# EAGLE design dual_sampler (EAGLE 8.3.2)
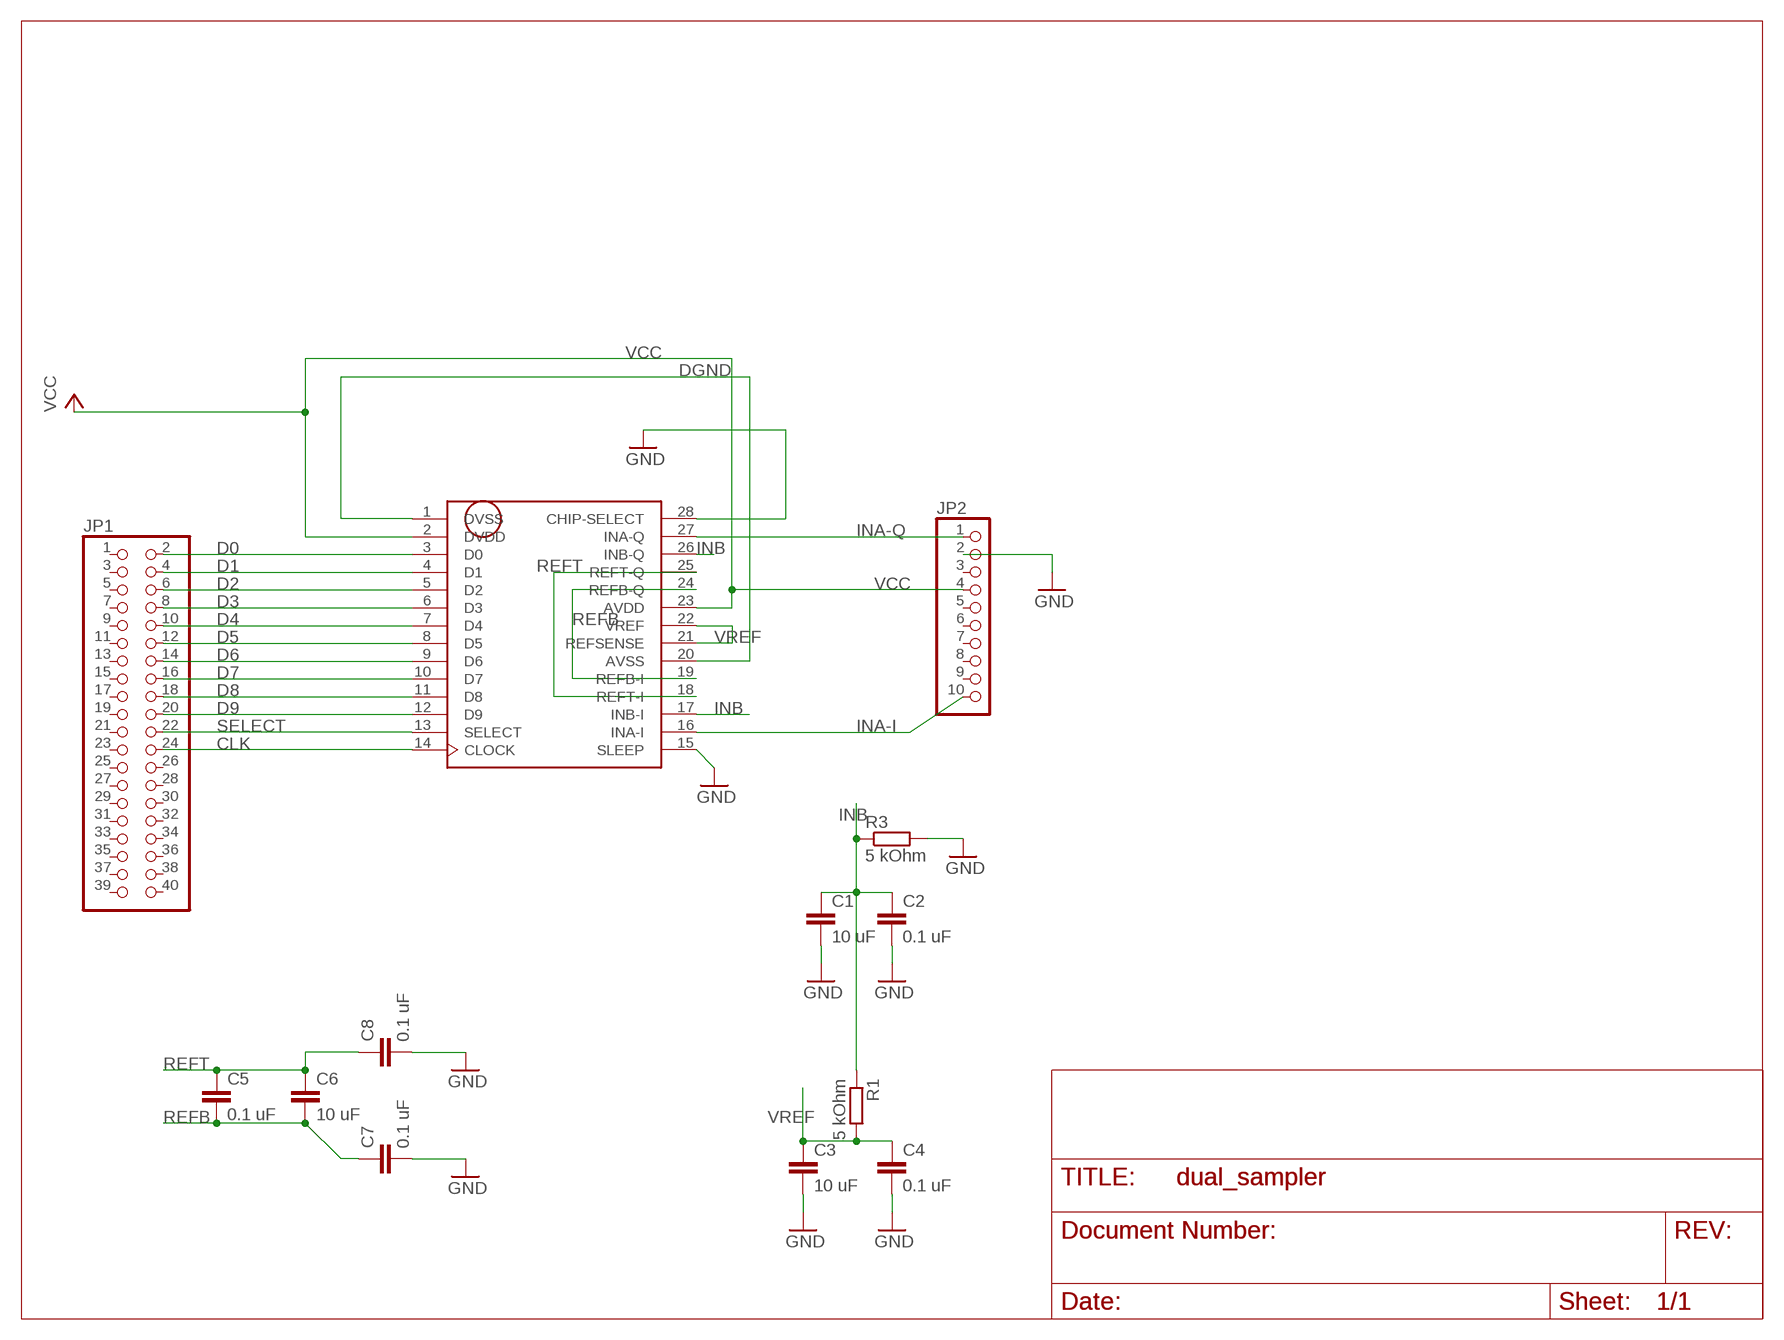
[diagram p0: schematic, sheet 1]

## Parts
C1  10 uF  C2,5-3  [C2.5-3]
C2  0.1 uF  C2,5-3  [C2.5-3]
C3  10 uF  C2,5-3  [C2.5-3]
C4  0.1 uF  C2,5-3  [C2.5-3]
C5  0.1 uF  C2,5-3  [C2.5-3]
C6  10 uF  C2,5-3  [C2.5-3]
C7  0.1 uF  C2,5-3  [C2.5-3]
C8  0.1 uF  C2,5-3  [C2.5-3]
JP1  PINHD-2X20  [2X20]
JP2  PINHD-1X10  [1X10]
R1  5 kOhm  R-EU_0204/7  [0204/7]
R3  5 kOhm  R-EU_0204/7  [0204/7]
U$1  AD9201ARSZ  [SSOP28]

## Nets
CLK: JP1.24 U$1.14(CLOCK)
D0: JP1.2 U$1.3(D0)
D1: JP1.4 U$1.4(D1)
D2: JP1.6 U$1.5(D2)
D3: JP1.8 U$1.6(D3)
D4: JP1.10 U$1.7(D4)
D5: JP1.12 U$1.8(D5)
D6: JP1.14 U$1.9(D6)
D7: JP1.16 U$1.10(D7)
D8: JP1.18 U$1.11(D8)
D9: JP1.20 U$1.12(D9)
DGND: U$1.1(DVSS) U$1.20(AVSS)
GND: C1.2 C2.2 C3.2 C4.2 C7.2 C8.2 JP2.2 R3.2 U$1.15(SLEEP) U$1.28(CHIP-SELECT)
INA-I: JP2.10 U$1.16(INA-I)
INA-Q: JP2.1 U$1.27(INA-Q)
INB: C1.1 C2.1 R1.1 R3.1 U$1.17(INB-I) U$1.26(INB-Q)
REFB: C5.2 C6.2 C7.1 U$1.19(REFB-I) U$1.24(REFB-Q)
REFT: C5.1 C6.1 C8.1 U$1.18(REFT-I) U$1.25(REFT-Q)
SELECT: JP1.22 U$1.13(SELECT)
VCC: JP2.4 U$1.2(DVDD) U$1.23(AVDD)
VREF: C3.1 C4.1 R1.2 U$1.21(REFSENSE) U$1.22(VREF)
Unconnected: JP1.1 JP1.3 JP1.5 JP1.7 JP1.9 JP1.11 JP1.13 JP1.15 JP1.17 JP1.19 JP1.21 JP1.23 JP1.25 JP1.26 JP1.27 JP1.28 JP1.29 JP1.30 JP1.31 JP1.32 JP1.33 JP1.34 JP1.35 JP1.36 JP1.37 JP1.38 JP1.39 JP1.40 JP2.3 JP2.5 JP2.6 JP2.7 JP2.8 JP2.9

## Library data of the parts
C1-C8 = capacitor-wima:C: CAPACITOR naming: grid - package width
JP1 = pinhead:PINHD-2X20: PIN HEADER
JP2 = pinhead:PINHD-1X10: PIN HEADER
R1 R3 = resistor:R-EU_: RESISTOR, European symbol
U$1 = sampler_lib:AD9201ARSZ: 20 MSPS 10 bit adc http://www.analog.com/media/en/technical-documentation/data-sheets/AD9201.pdf

## Board
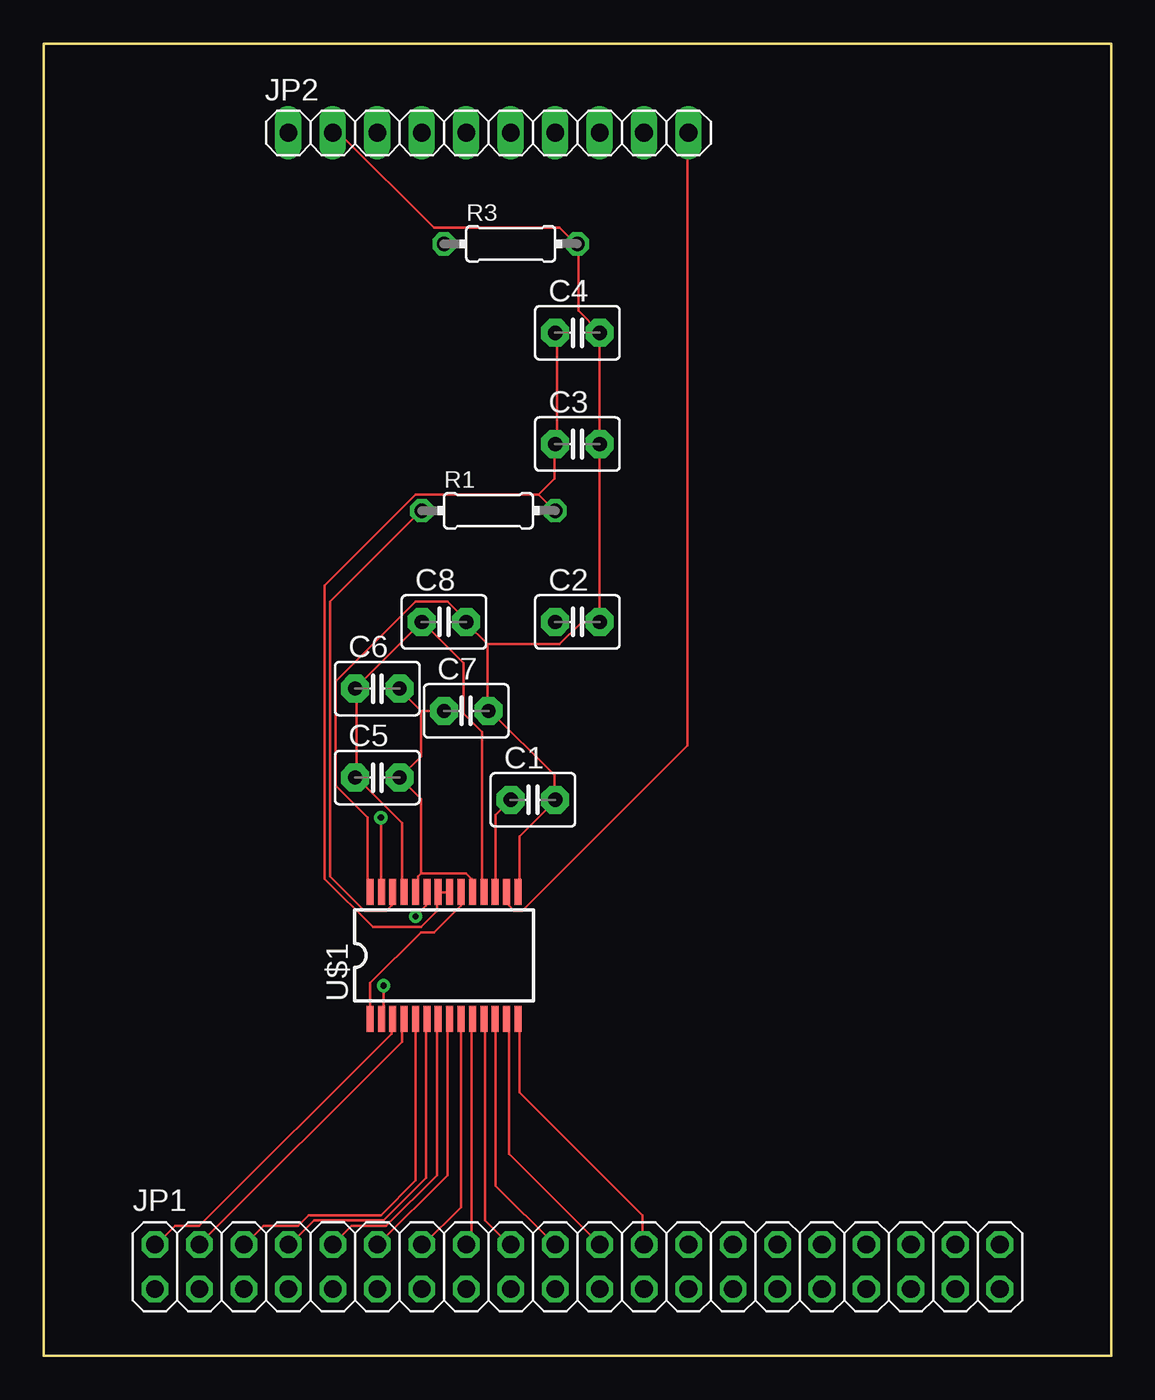
[diagram p1: board, top side]
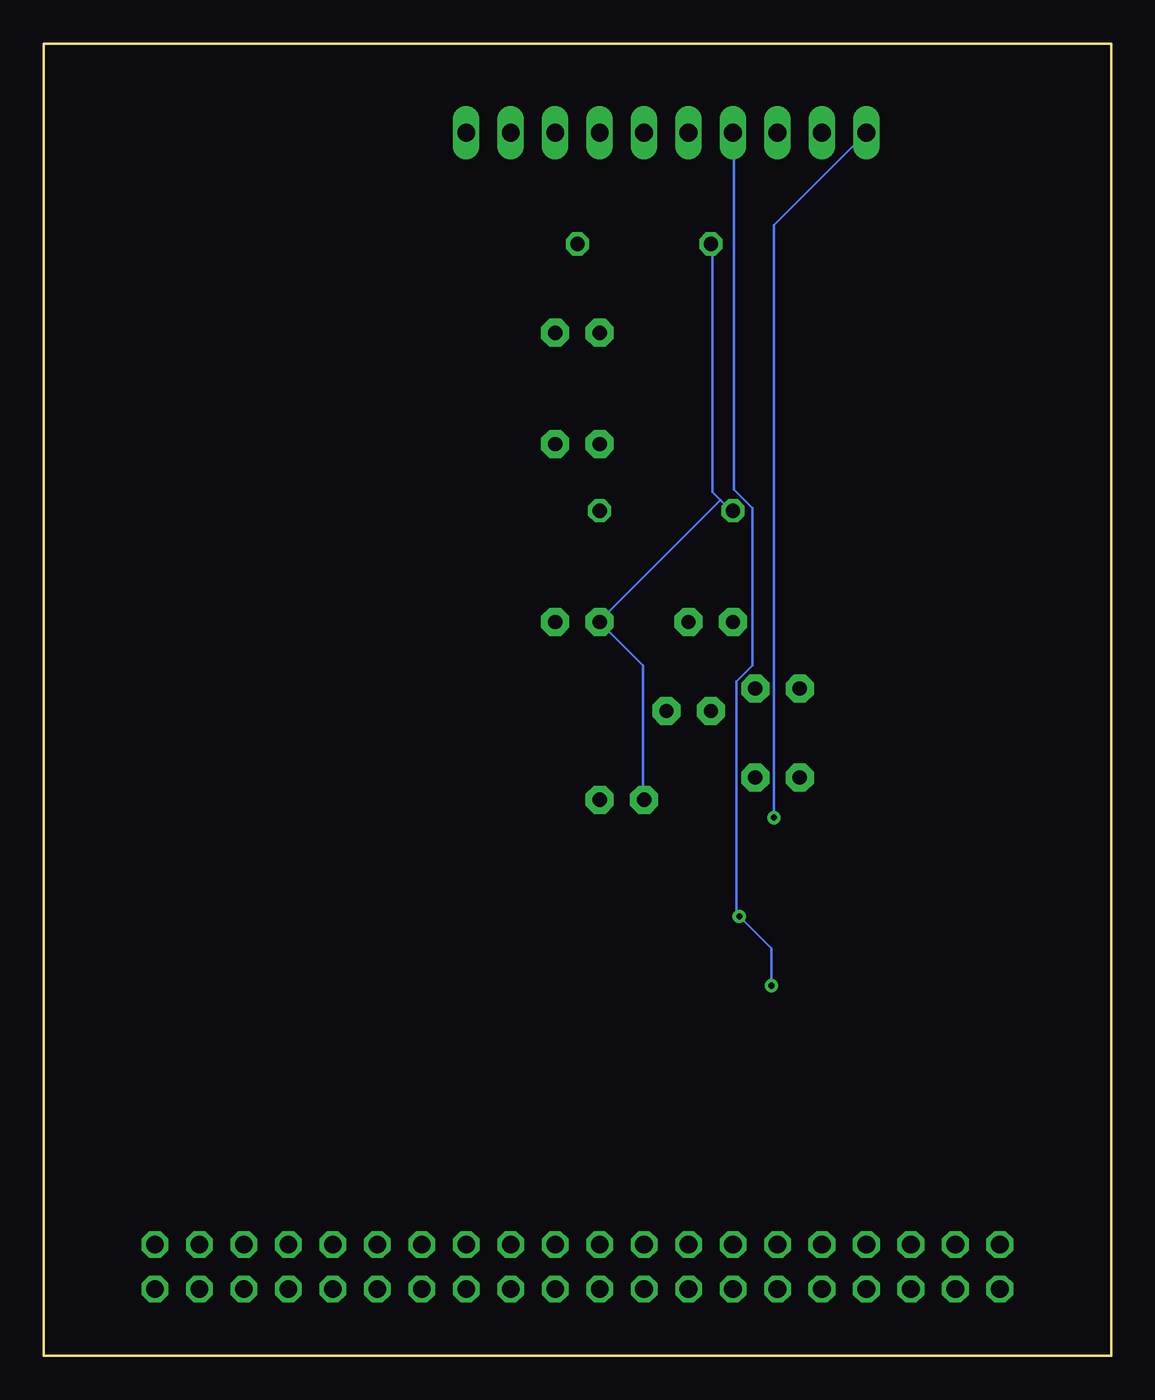
[diagram p2: board, bottom side, seen from below]

Size 60.96 x 74.93 mm. Coordinates in mm from the lower left corner, seen from the top.
Outline: 0,74.93 0,0 60.96,0 60.96,74.93 0,74.93
Copper layers (1*16): Top 0.035mm / dielectric 1.5mm / Bottom 0.035mm
Design rules "default": minimum track width 6mil, minimum drill 0.35mm, track to track 6mil, track to pad 6mil, pad to pad 6mil, via to via 6mil, smd to smd 6mil, copper to edge 40mil, drill to drill 6mil, minimum pad ring 10mil, minimum via ring 8mil, stop-mask expansion 4mil, vias tented up to drill 0mil, thermal gap 10mil

### Footprints (pad centres in the part's own frame; a part is rotated, then mirrored left to right if it is on the bottom)
C2.5-3 = drill 0.813 pad 1.6 octagon: 1 -1.27,0; 2 1.27,0
2X20 = drill 1.016 octagon: 1 -24.13,-1.27; 2 -24.13,1.27; 3 -21.59,-1.27; 4 -21.59,1.27; 5 -19.05,-1.27; 6 -19.05,1.27; 7 -16.51,-1.27; 8 -16.51,1.27; 9 -13.97,-1.27; 10 -13.97,1.27; 11 -11.43,-1.27; 12 -11.43,1.27; 13 -8.89,-1.27; 14 -8.89,1.27; 15 -6.35,-1.27; 16 -6.35,1.27; 17 -3.81,-1.27; 18 -3.81,1.27; 19 -1.27,-1.27; 20 -1.27,1.27; 21 1.27,-1.27; 22 1.27,1.27; 23 3.81,-1.27; 24 3.81,1.27; 25 6.35,-1.27; 26 6.35,1.27; 27 8.89,-1.27; 28 8.89,1.27; 29 11.43,-1.27; 30 11.43,1.27; 31 13.97,-1.27; 32 13.97,1.27; 33 16.51,-1.27; 34 16.51,1.27; 35 19.05,-1.27; 36 19.05,1.27; 37 21.59,-1.27; 38 21.59,1.27; 39 24.13,-1.27; 40 24.13,1.27
1X10 = drill 1.016 long: 1 -11.43,0; 2 -8.89,0; 3 -6.35,0; 4 -3.81,0; 5 -1.27,0; 6 1.27,0; 7 3.81,0; 8 6.35,0; 9 8.89,0; 10 11.43,0
0204/7 = drill 0.813 octagon: 1 -3.81,0; 2 3.81,0
SSOP28 = smd 0.4 x 1.5: 1 -4.225,-3.625; 2 -3.575,-3.625; 3 -2.925,-3.625; 4 -2.275,-3.625; 5 -1.625,-3.625; 6 -0.975,-3.625; 7 -0.325,-3.625; 8 0.325,-3.625; 9 0.975,-3.625; 10 1.625,-3.625; 11 2.275,-3.625; 12 2.925,-3.625; 13 3.575,-3.625; 14 4.225,-3.625; 15 4.225,3.625; 16 3.575,3.625; 17 2.925,3.625; 18 2.275,3.625; 19 1.625,3.625; 20 0.975,3.625; 21 0.325,3.625; 22 -0.325,3.625; 23 -0.975,3.625; 24 -1.625,3.625; 25 -2.275,3.625; 26 -2.925,3.625; 27 -3.575,3.625; 28 -4.225,3.625

### Placement (x,y rotation side)
C1  [C2.5-3]  27.94,31.75 0 top
C2  [C2.5-3]  30.48,41.91 0 top
C3  [C2.5-3]  30.48,52.07 0 top
C4  [C2.5-3]  30.48,58.42 0 top
C5  [C2.5-3]  19.05,33.02 0 top
C6  [C2.5-3]  19.05,38.1 0 top
C7  [C2.5-3]  24.13,36.83 0 top
C8  [C2.5-3]  22.86,41.91 0 top
JP1  30.48,5.08 0 top
JP2  25.4,69.85 0 top
R1  [0204/7]  25.4,48.26 0 top
R3  [0204/7]  26.67,63.5 0 top
U$1  22.86,22.86 0 top

### Tracks (layer width: path | path; a pad name or v marks a point on that pad's centre or on a via)
CLK
  Top 0.152: U$1.14 27.18,19.15 27.18,15.04 34.19,8.03 34.19,6.35 JP1.24
D0
  Top 0.152: U$1.3 19.86,19.15 19.86,18.39 8.89,7.42 7.52,7.42 6.45,6.35 JP1.2
D1
  Top 0.152: JP1.4 20.47,17.93 20.47,19.15 U$1.4
D2
  Top 0.152: U$1.5 21.23,19.15 21.23,10.01 19.25,8.03 15.14,8.03 14.53,7.42 12.55,7.42 11.48,6.35 JP1.6
D3
  Top 0.152: U$1.6 21.84,19.15 21.84,10.16 19.41,7.72 15.44,7.72 14.07,6.35 JP1.8
D4
  Top 0.152: JP1.10 17.58,7.42 19.56,7.42 22.45,10.31 22.45,19.15 U$1.7
D5
  Top 0.152: U$1.8 23.06,19.15 23.06,10.31 19.1,6.35 JP1.12
D6
  Top 0.152: U$1.9 23.82,19.15 23.82,8.48 21.69,6.35 JP1.14
D7
  Top 0.152: JP1.16 24.44,6.65 24.44,19.15 U$1.10
D8
  Top 0.152: U$1.11 25.2,19.15 25.2,7.72 26.57,6.35 JP1.18
D9
  Top 0.152: U$1.12 25.81,19.15 25.81,9.7 29.16,6.35 JP1.20
DGND
  Top 0.152: U$1.1 18.64,19.3 18.64,21.29 21.54,24.18 22.3,24.18 23.82,25.71 23.82,26.47 U$1.20
GND
  Top 0.152: U$1.15 27.18,26.62 27.18,29.67 29.16,31.65 C1.2 29.16,31.8 29.16,33.17 25.5,36.83 C7.2 25.35,36.83 25.35,40.64 | U$1.28 18.49,26.62 18.49,30.73 16.66,32.56 16.66,38.51 21.23,43.08 23.06,43.08 24.13,42.01 C8.2 24.13,41.86 25.35,40.64 | 25.35,40.64 29.46,40.64 30.68,41.86 31.75,41.86 C2.2 C3.2 C4.2 31.75,58.47 30.53,59.69 30.53,63.5 R3.2 30.38,63.5 29.46,64.41 22.3,64.41 16.97,69.75 16.51,69.75 JP2.2
INA-I
  Top 0.152: U$1.16 26.57,26.47 26.57,25.71 26.87,25.4 27.33,25.4 36.78,34.85 36.78,69.75 JP2.10
INA-Q  (via drill 0.35)
  Top 0.152: v19.25,30.73 19.25,26.62 U$1.27
  Bottom 0.152: v19.25,30.73 19.25,64.57 JP2.1
INB
  Top 0.152: C1.1 25.81,30.89 25.81,26.62 U$1.17 | U$1.26 19.86,26.47 19.86,25.71 19.56,25.4 18.34,25.4 16.36,27.38 16.36,43.08 21.54,48.26 R1.1
  Bottom 0.152: 22.3,48.87 21.69,48.26 R1.1 | 22.3,48.87 22.76,49.33 22.76,63.5 R3.1 | 22.3,48.87 29.16,42.01 C2.1 26.72,39.42 26.72,31.8 C1.1
REFB
  Top 0.152: 21.54,36.83 C7.1 | 21.54,36.83 20.32,38.05 C6.2 | 21.54,27.53 21.39,27.38 21.39,26.62 U$1.24 | 21.54,27.53 24.13,27.53 24.44,27.23 24.44,26.62 U$1.19 | 21.54,27.53 21.54,31.8 C5.2 21.54,34.24 21.54,36.83
REFT
  Top 0.152: 17.88,33.02 20.47,30.43 20.47,26.62 U$1.25 | 17.88,33.02 17.88,38.05 C6.1 C8.1 21.69,41.86 23.98,39.57 23.98,36.68 25.04,35.61 25.04,26.62 U$1.18 | 17.88,33.02 C5.1
SELECT
  Top 0.152: JP1.22 26.57,11.53 26.57,19.15 U$1.13
VCC  (via drill 0.35)
  Top 0.152: v19.41,21.13 19.41,19.3 U$1.2 | v21.23,25.09 21.84,25.71 21.84,26.47 U$1.23
  Bottom 0.152: v19.41,21.13 19.41,23.27 v21.23,25.09 21.39,25.25 21.39,38.51 20.47,39.42 20.47,48.41 21.54,49.48 21.54,69.75 JP2.4
VREF
  Top 0.152: U$1.21 23.06,26.47 22.61,26.47 U$1.22 22.45,26.47 22.45,25.4 21.54,24.49 18.8,24.49 16.05,27.23 16.05,43.99 21.23,49.17 28.24,49.17 | 28.24,49.17 29.16,48.26 R1.2 | 28.24,49.17 29.16,50.09 29.16,52.07 C3.1 29.31,52.07 29.31,58.32 C4.1